# Altium schematic sheet Buck.SchDoc
size A4
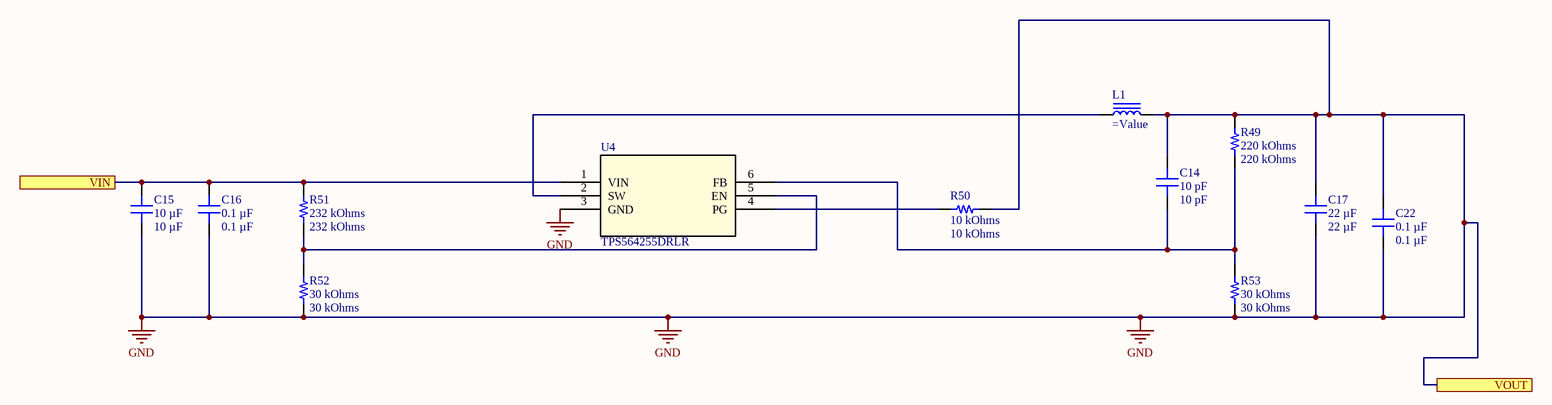
[diagram p0: Buck.SchDoc]

## Parts
C14  10 pF  [CAP 0805_2012]
C15  10 µF  [CAP 0805_2012]
C16  0.1 µF  [CAP 0805_2012]
C17  22 µF  [CAP 0805_2012]
C22  0.1 µF  [CAP 0805_2012]
L1  (no value)  [WURTH WE-PD 1245]
R49  220 kOhms  [RES 0805_2012]
R50  10 kOhms  [RES 0805_2012]
R51  232 kOhms  [RES 0805_2012]
R52  30 kOhms  [RES 0805_2012]
R53  30 kOhms  [RES 0805_2012]
U4  TPS564255DRLR  [TPS564242DRLR_TEX]

## Ports
VIN, VOUT

## Nets
GND: C14.2 C15.1 C16.1 C17.1 C17.2 C22.1 C22.2 L1.2 R49.2 R50.2 R52.1 R53.1 U4.3(GND) ; port VOUT
VIN: C15.2 C16.2 R51.2 U4.1(VIN) ; port VIN
NetC14_1: C14.1 R49.1 R53.2 U4.6(FB)
NetL1_1: L1.1 U4.2(SW)
NetR50_1: R50.1 U4.4(PG)
NetR51_1: R51.1 R52.2 U4.5(EN)

## Library data of the parts
C14 = GQM2195C2E100JB12D: CAP CER 10PF 250V C0G/NP0 0805; Part Number: GQM2195C2E100JB12D; Value: 10 pF
C15 = CL21Y106KPQVPNE: CAP CER 10UF 10V X7S 0805; Part Number: CL21Y106KPQVPNE; Value: 10 µF
C16 C22 = CC0805MRX7R9BB104: CAP CER 0.1UF 50V X7R 0805; Part Number: CC0805MRX7R9BB104; Value: 0.1 µF
C17 = CL21A226KOQNNNE: CAP CER 22UF 16V X5R 0805; Part Number: CL21A226KOQNNNE; Value: 22 µF
L1 = 7447715004: FIXED IND 4.7UH 5.2A 16 MOHM SMD; Part Number: 7447715004
R49 = CRGP0805F220K: RES 220K OHM 1% 1/3W 0805; Part Number: CRGP0805F220K; Value: 220 kOhms
R50 = RNCS0805BKE10K0: RES 10K OHM 0.1% 1/10W 0805; Part Number: RNCS0805BKE10K0; Value: 10 kOhms
R51 = CRCW0805232KFKEA: RES SMD 232K OHM 1% 1/8W 0805; Part Number: CRCW0805232KFKEA; Value: 232 kOhms
R52 R53 = RNCF0805DTE30K0: RES 30K OHM 0.5% 1/8W 0805; Part Number: RNCF0805DTE30K0; Value: 30 kOhms
U4 = TPS564255DRLR: No Description Available; Mfr_Name: Texas Instruments; Type: DEV; Copyright: Copyright (C) 2023 Ultra Librarian. All rights reserved.; Manufacturer_Part_Number: TPS564255DRLR; RefDes: RefDes